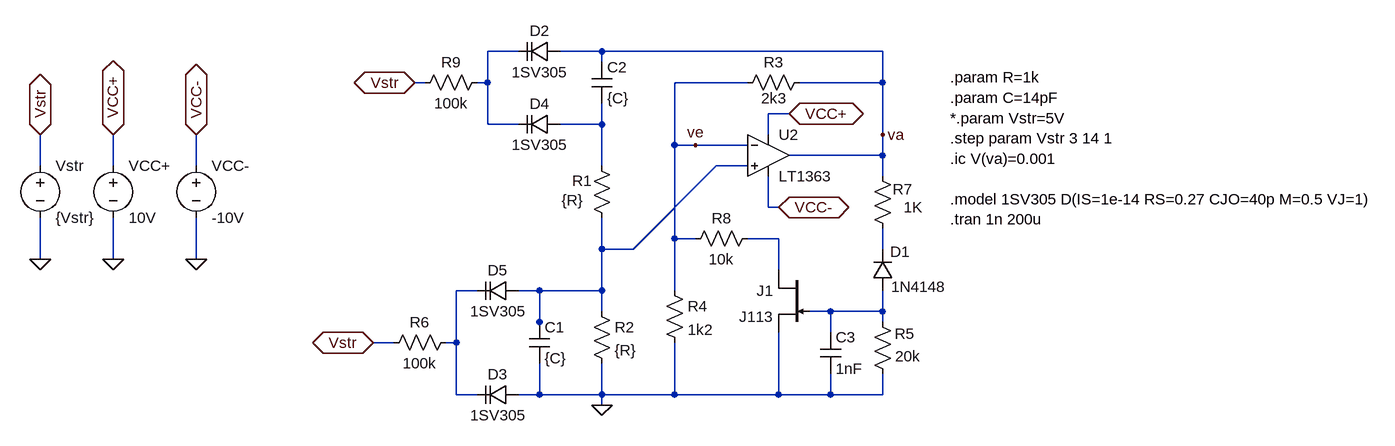
[diagram p0: schematic Wien-LT.asc]
Wien-LT.asc, the LTspice schematic file:
Version 4
SHEET 1 1468 680
WIRE 64 -2704 16 -2704
WIRE 192 -2704 128 -2704
WIRE 624 -2704 192 -2704
WIRE 192 -2688 192 -2704
WIRE -80 -2656 -96 -2656
WIRE 16 -2656 16 -2704
WIRE 16 -2656 0 -2656
WIRE 416 -2656 304 -2656
WIRE 624 -2656 624 -2704
WIRE 624 -2656 496 -2656
WIRE 480 -2608 448 -2608
WIRE 16 -2592 16 -2656
WIRE 64 -2592 16 -2592
WIRE 192 -2592 192 -2624
WIRE 192 -2592 128 -2592
WIRE 448 -2576 448 -2608
WIRE 624 -2576 624 -2656
WIRE 304 -2560 304 -2656
WIRE 336 -2560 304 -2560
WIRE 416 -2560 336 -2560
WIRE 624 -2544 624 -2576
WIRE 624 -2544 480 -2544
WIRE -672 -2528 -672 -2576
WIRE -560 -2528 -560 -2576
WIRE -432 -2528 -432 -2576
WIRE 192 -2528 192 -2592
WIRE 416 -2528 368 -2528
WIRE 624 -2512 624 -2544
WIRE 448 -2464 448 -2512
WIRE 464 -2464 448 -2464
WIRE 304 -2416 304 -2560
WIRE 336 -2416 304 -2416
WIRE 464 -2416 416 -2416
WIRE 192 -2400 192 -2448
WIRE 240 -2400 368 -2528
WIRE 240 -2400 192 -2400
WIRE 624 -2400 624 -2432
WIRE -672 -2384 -672 -2448
WIRE -560 -2384 -560 -2448
WIRE -432 -2384 -432 -2448
WIRE 464 -2368 464 -2416
WIRE 0 -2336 -32 -2336
WIRE 96 -2336 64 -2336
WIRE 192 -2336 192 -2400
WIRE 192 -2336 96 -2336
WIRE 304 -2336 304 -2416
WIRE 192 -2304 192 -2336
WIRE 544 -2304 512 -2304
WIRE 624 -2304 624 -2336
WIRE 624 -2304 544 -2304
WIRE 96 -2288 96 -2336
WIRE 624 -2288 624 -2304
WIRE 96 -2272 96 -2288
WIRE 544 -2272 544 -2304
WIRE -128 -2256 -160 -2256
WIRE -32 -2256 -32 -2336
WIRE -32 -2256 -48 -2256
WIRE -32 -2176 -32 -2256
WIRE 0 -2176 -32 -2176
WIRE 96 -2176 96 -2224
WIRE 96 -2176 64 -2176
WIRE 192 -2176 192 -2224
WIRE 192 -2176 96 -2176
WIRE 304 -2176 304 -2256
WIRE 304 -2176 192 -2176
WIRE 464 -2176 464 -2272
WIRE 464 -2176 304 -2176
WIRE 544 -2176 544 -2208
WIRE 544 -2176 464 -2176
WIRE 624 -2176 624 -2208
WIRE 624 -2176 544 -2176
WIRE 192 -2160 192 -2176
FLAG 192 -2160 0
FLAG -560 -2576 VCC+
IOPIN -560 -2576 BiDir
FLAG -432 -2576 VCC-
IOPIN -432 -2576 BiDir
FLAG 480 -2608 VCC+
IOPIN 480 -2608 BiDir
FLAG 464 -2464 VCC-
IOPIN 464 -2464 BiDir
FLAG -432 -2384 0
FLAG -560 -2384 0
FLAG -672 -2384 0
FLAG -96 -2656 Vstr
IOPIN -96 -2656 BiDir
FLAG -160 -2256 Vstr
IOPIN -160 -2256 BiDir
FLAG -672 -2576 Vstr
IOPIN -672 -2576 BiDir
FLAG 336 -2560 ve
FLAG 624 -2576 va
SYMBOL cap 80 -2288 R0
SYMATTR InstName C1
SYMATTR Value {C}
SYMBOL cap 176 -2688 R0
SYMATTR InstName C2
SYMATTR Value {C}
SYMBOL res 176 -2320 R0
SYMATTR InstName R2
SYMATTR Value {R}
SYMBOL res 288 -2352 R0
SYMATTR InstName R4
SYMATTR Value 1k2
SYMBOL res 432 -2432 R90
WINDOW 0 0 56 VBottom 2
WINDOW 3 32 56 VTop 2
SYMATTR InstName R8
SYMATTR Value 10k
SYMBOL res 640 -2192 R180
WINDOW 0 -33 78 Left 2
WINDOW 3 -42 43 Left 2
SYMATTR InstName R5
SYMATTR Value 20k
SYMBOL res 640 -2416 R180
WINDOW 0 -30 76 Left 2
WINDOW 3 -46 48 Left 2
SYMATTR InstName R7
SYMATTR Value 1K
SYMBOL res 400 -2640 R270
WINDOW 0 32 56 VTop 2
WINDOW 3 8 57 VBottom 2
SYMATTR InstName R3
SYMATTR Value 2k3
SYMBOL res 176 -2544 R0
WINDOW 0 -30 39 Left 2
WINDOW 3 -46 69 Left 2
SYMATTR InstName R1
SYMATTR Value {R}
SYMBOL res 16 -2672 R90
WINDOW 0 0 56 VBottom 2
WINDOW 3 32 56 VTop 2
SYMATTR InstName R9
SYMATTR Value 100k
SYMBOL res -32 -2272 R90
WINDOW 0 0 56 VBottom 2
WINDOW 3 32 56 VTop 2
SYMATTR InstName R6
SYMATTR Value 100k
SYMBOL diode 640 -2336 R180
WINDOW 0 -26 60 Left 2
WINDOW 3 -82 6 Left 2
SYMATTR InstName D1
SYMATTR Value 1N4148
SYMBOL cap 528 -2272 R0
SYMATTR InstName C3
SYMATTR Value 1nF
SYMBOL varactor 64 -2352 R90
WINDOW 0 0 32 VBottom 2
WINDOW 3 32 32 VTop 2
SYMATTR InstName D5
SYMATTR Value 1SV305
SYMBOL varactor 64 -2192 R90
WINDOW 0 0 32 VBottom 2
WINDOW 3 32 32 VTop 2
SYMATTR InstName D3
SYMATTR Value 1SV305
SYMBOL varactor 128 -2720 R90
WINDOW 0 0 32 VBottom 2
WINDOW 3 32 32 VTop 2
SYMATTR InstName D2
SYMATTR Value 1SV305
SYMBOL voltage -432 -2544 R0
SYMATTR InstName VCC-
SYMATTR Value -10V
SYMBOL voltage -560 -2544 R0
SYMATTR InstName VCC+
SYMATTR Value 10V
SYMBOL voltage -672 -2544 R0
SYMATTR InstName Vstr
SYMATTR Value {Vstr}
SYMBOL OpAmps\\LT1363 448 -2608 R0
SYMATTR InstName U2
SYMBOL varactor 128 -2608 R90
WINDOW 0 0 32 VBottom 2
WINDOW 3 32 32 VTop 2
SYMATTR InstName D4
SYMATTR Value 1SV305
SYMBOL njf 512 -2368 M0
SYMATTR InstName J1
SYMATTR Value J113
TEXT 728 -2664 Left 2 !.param R=1k\n.param C=14pF\n*.param Vstr=5V\n.step param Vstr 3 14 1\n.ic V(va)=0.001\n \n.model 1SV305 D(IS=1e-14 RS=0.27 CJO=40p M=0.5 VJ=1)\n.tran 1n 200u

The netlist it stands for:
* Wien-LT.asc
C1 N003 0 {C}
C2 va N002 {C}
R2 N003 0 {R}
R4 ve 0 1k2
R8 N004 ve 10k
R5 0 N007 20k
R7 N005 va 1K
R3 ve va 2k3
R1 N002 N003 {R}
R9 N001 Vstr 100k
R6 N006 Vstr 100k
D1 N007 N005 1N4148
C3 N007 0 1nF
D5 N003 N006 1SV305
D3 0 N006 1SV305
D2 va N001 1SV305
VCC- VCC- 0 -10V
VCC+ VCC+ 0 10V
Vstr Vstr 0 {Vstr}
XU2 N003 ve VCC+ VCC- va LT1363  ; pins In+ In- V+ V- OUT
D4 N002 N001 1SV305
J1 N004 N007 0 J113
.model D D
.lib standard.dio
.model NJF NJF
.model PJF PJF
.lib standard.jft
.param R=1k
.param C=14pF
*.param Vstr=5V
.step param Vstr 3 14 1
.ic V(va)=0.001
.model 1SV305 D(IS=1e-14 RS=0.27 CJO=40p M=0.5 VJ=1)
.tran 1n 200u
.lib LT1363.sub
.backanno
.end